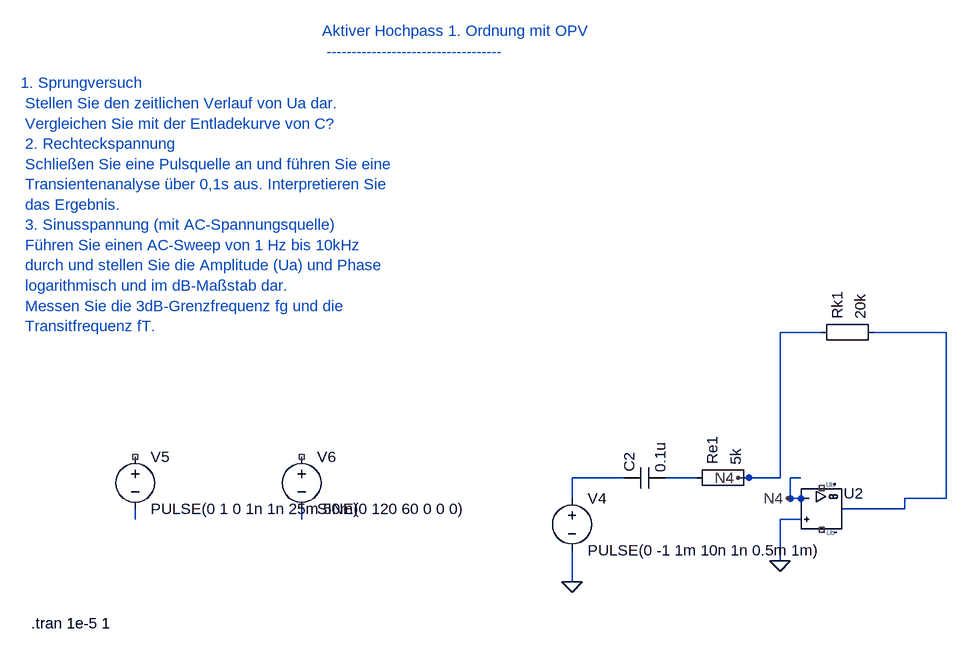
[diagram p0: schematic 7_4_1_Aktiver_Hochpass.asc]
7_4_1_Aktiver_Hochpass.asc, the LTspice schematic file:
Version 4
SHEET 1 880 680
WIRE 1040 768 1056 768
WIRE 1248 800 1232 800
WIRE 1232 800 1232 768
WIRE 1232 768 1248 768
WIRE 1312 816 1408 816
WIRE 1408 816 1408 800
WIRE 896 880 896 896
WIRE 224 816 224 832
WIRE 480 816 480 832
WIRE 1216 768 1168 768
WIRE 1248 832 1216 832
WIRE 1216 832 1216 896
WIRE 1408 800 1472 800
WIRE 1472 800 1472 544
WIRE 1472 544 1360 544
WIRE 1280 544 1216 544
WIRE 1216 544 1216 768
WIRE 1056 768 1088 768
WIRE 896 896 896 928
WIRE 896 800 896 768
WIRE 896 768 976 768
WIRE 1168 768 1152 768
WIRE 1248 800 1228 800
FLAG 1216 896 0
FLAG 896 928 0
FLAG 1216 896 0
FLAG 896 928 0
FLAG 1152 768 N4
FLAG 1228 800 N4
SYMBOL Misc\EuropeanResistor 1072 784 R270
SYMATTR InstName Re1
SYMATTR Value 5k
SYMBOL cap 976 784 R270
SYMATTR InstName C2
SYMATTR Value 0.1u
SYMBOL UniversalOpAmp2 1280 816 R0
SYMATTR InstName U2
SYMATTR Value UniversalOpAmp2
SYMBOL Misc\EuropeanResistor 1264 560 R270
SYMATTR InstName Rk1
SYMATTR Value 20k
SYMBOL voltage 896 784 R0
SYMATTR InstName V4
SYMATTR Value PULSE(0 -1 1m 10n 1n 0.5m 1m)
SYMBOL voltage 224 720 R0
SYMATTR InstName V5
SYMATTR Value PULSE(0 1 0 1n 1n 25m 50m)
SYMBOL voltage 480 720 R0
SYMATTR InstName V6
SYMATTR Value SINE(0 120 60 0 0 0)
TEXT 64 992 Left 2 !.tran 1e-5 1
TEXT 512 80 Left 2 ;Aktiver Hochpass 1. Ordnung mit OPV \n -----------------------------------
TEXT 48 160 Left 2 ;1. Sprungversuch \n Stellen Sie den zeitlichen Verlauf von Ua dar. \n Vergleichen Sie mit der Entladekurve von C? \n 2. Rechteckspannung \n Schließen Sie eine Pulsquelle an und führen Sie eine \n Transientenanalyse über 0,1s aus. Interpretieren Sie \n das Ergebnis. \n 3. Sinusspannung (mit AC-Spannungsquelle) \n Führen Sie einen AC-Sweep von 1 Hz bis 10kHz \n durch und stellen Sie die Amplitude (Ua) und Phase \n logarithmisch und im dB-Maßstab dar. \n Messen Sie die 3dB-Grenzfrequenz fg und die \n Transitfrequenz fT.

The netlist it stands for:
* 7_4_1_Aktiver_Hochpass.asc
Re1 N001 N4 5k
C2 N005 N001 0.1u
XU2 0 N4 NC_01 NC_02 N002 level2 UniversalOpAmp2 Avol=1Meg GBW=10Meg Slew=10Meg Ilimit=25m Rail=0 Vos=0 En=0 Enk=0 In=0 Ink=0 Rin=500Meg  ; pins In+ In- V+ V- OUT
Rk1 N4 N002 20k
V4 N005 0 PULSE(0 -1 1m 10n 1n 0.5m 1m)
V5 NC_03 N003 PULSE(0 1 0 1n 1n 25m 50m)
V6 NC_04 N004 SINE(0 120 60 0 0 0)
.tran 1e-5 1
* Aktiver Hochpass 1. Ordnung mit OPV
*  -----------------------------------
* 1. Sprungversuch
*  Stellen Sie den zeitlichen Verlauf von Ua dar.
*  Vergleichen Sie mit der Entladekurve von C?
*  2. Rechteckspannung
*  Schließen Sie eine Pulsquelle an und führen Sie eine
*  Transientenanalyse über 0,1s aus. Interpretieren Sie
*  das Ergebnis.
*  3. Sinusspannung (mit AC-Spannungsquelle)
*  Führen Sie einen AC-Sweep von 1 Hz bis 10kHz
*  durch und stellen Sie die Amplitude (Ua) und Phase
*  logarithmisch und im dB-Maßstab dar.
*  Messen Sie die 3dB-Grenzfrequenz fg und die
*  Transitfrequenz fT.
.lib UniversalOpAmp2.lib
.backanno
.end